# Altium schematic sheet EEG-Electrodes.SchDoc: 16 CHANNEL EEG MONITOR
size 431 x 279 mm; ApprovedBy: NA; CheckedBy: NA; Author: ANDY NGUYEN; CompanyName: NA; DrawnBy: ANDY NGUYEN; Engineer: ANDY NGUYEN; Revision: 1; ENG_APP_DATE: --/--/--; DSN_APP_DATE: --/--/--; CHK_APP_DATE: --/--/--
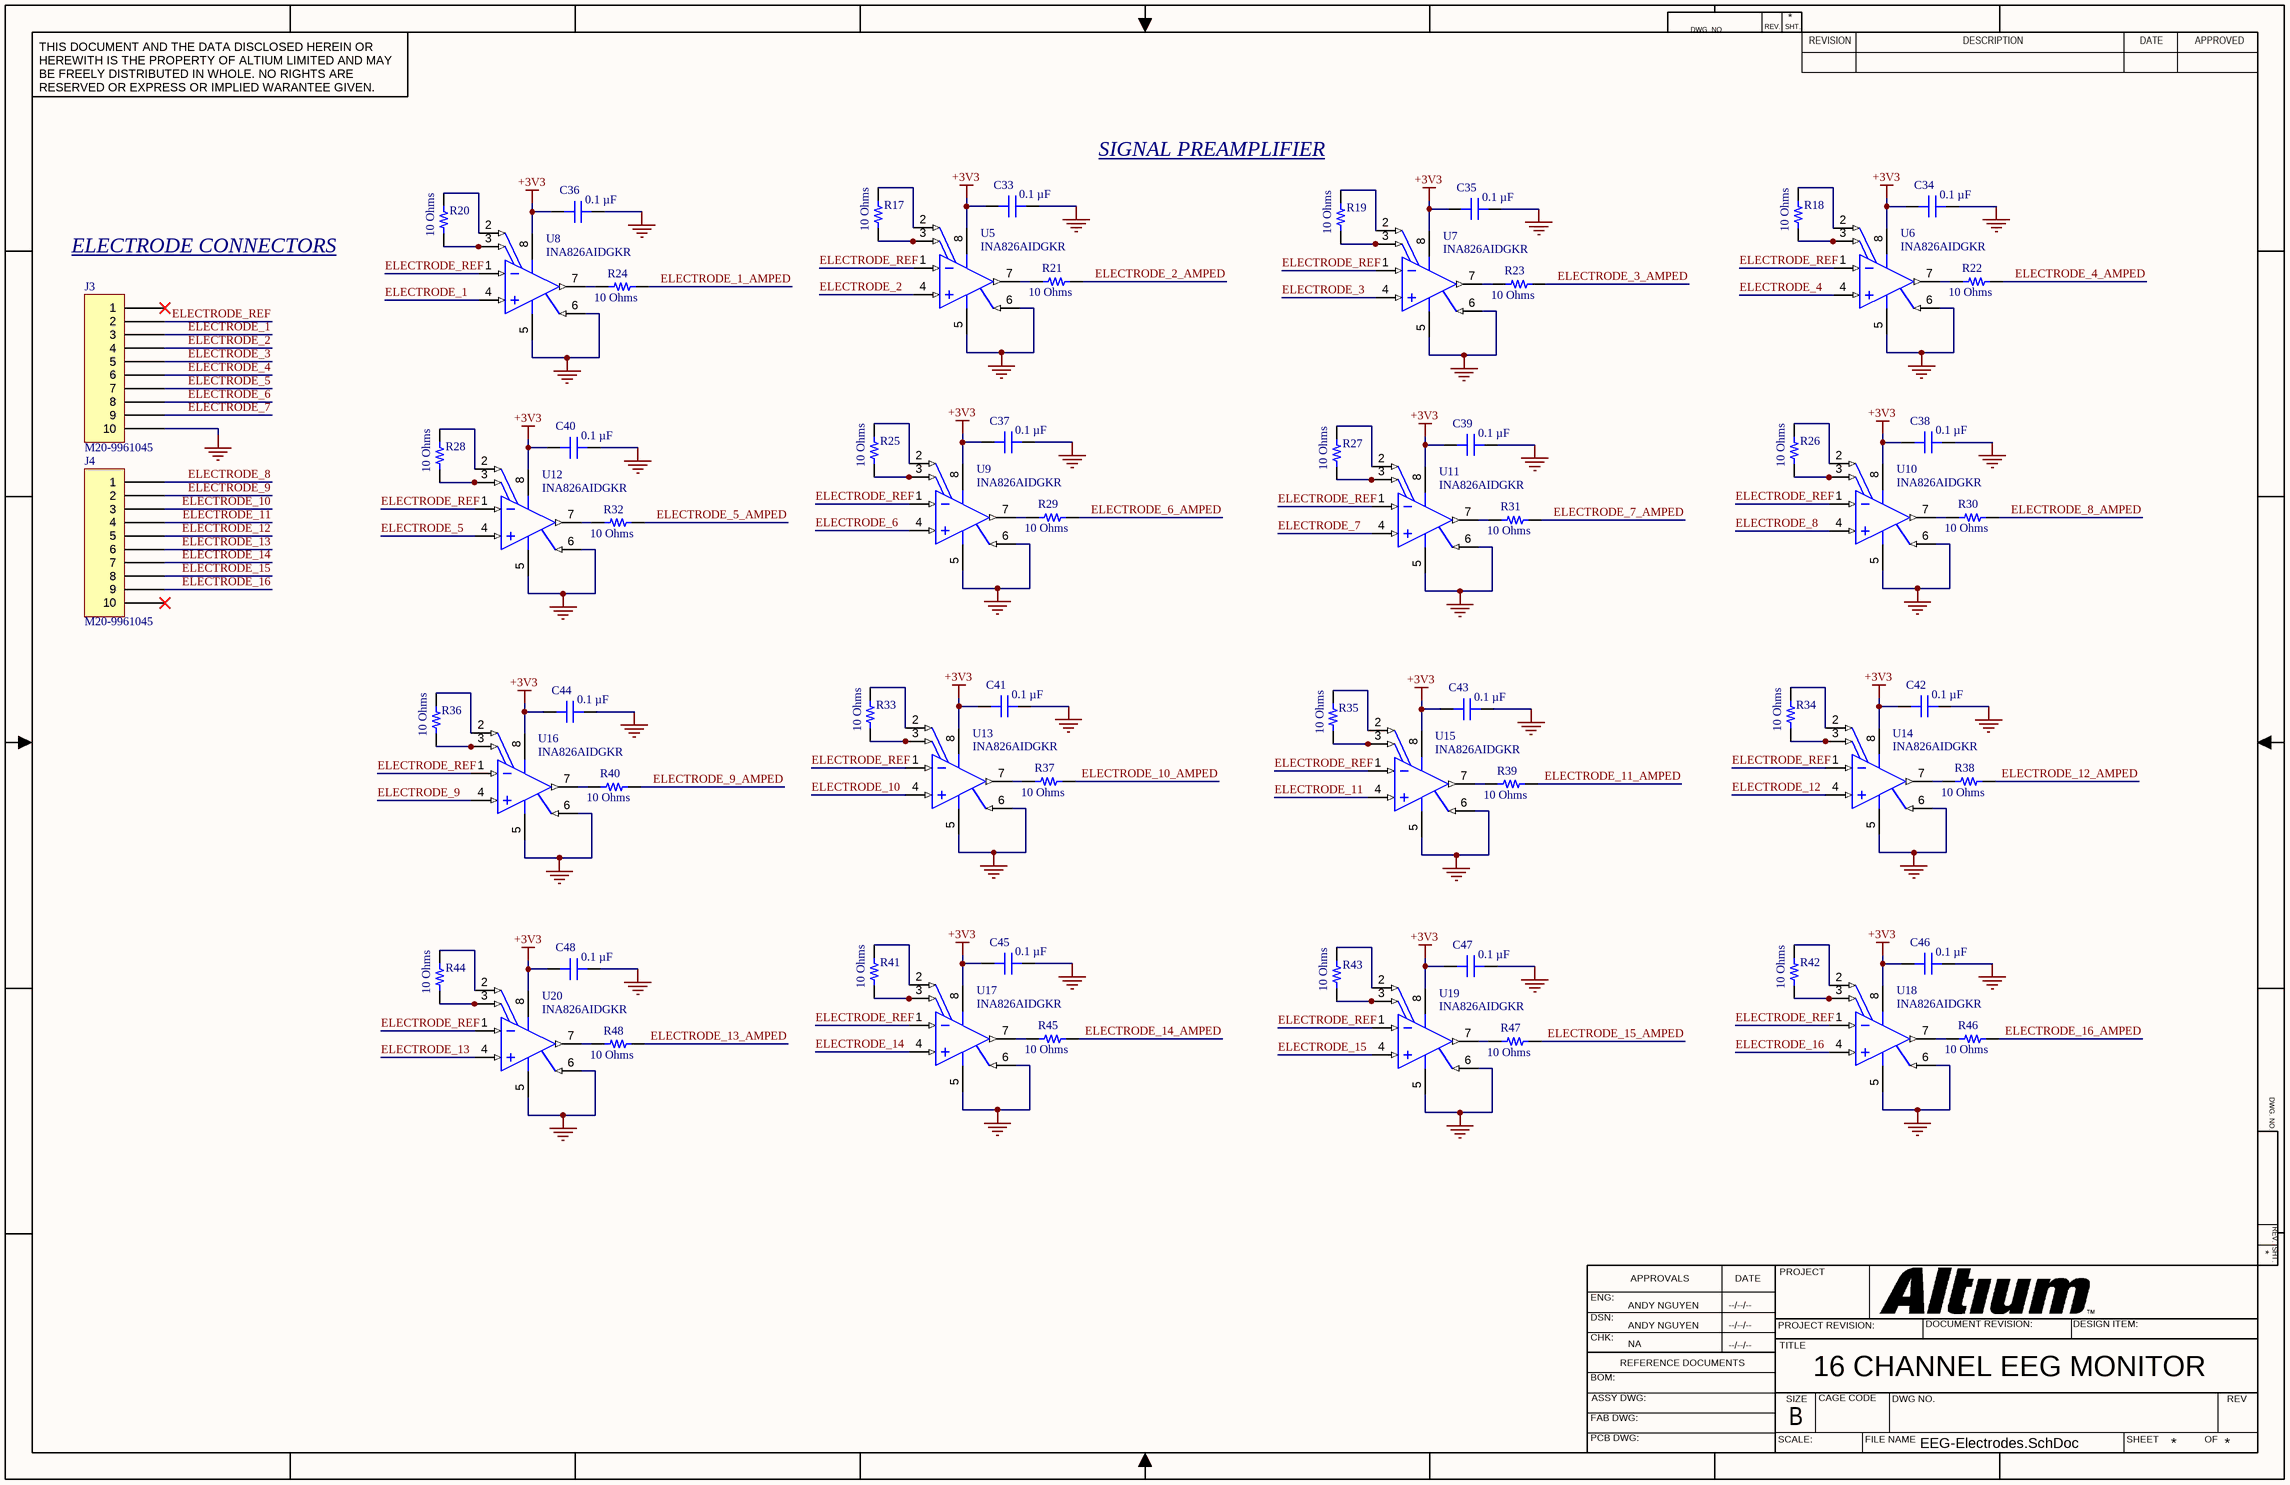
[diagram p0: EEG-Electrodes.SchDoc]

## Parts
C33  0.1 µF  [CAP 0402_1005]
C34  0.1 µF  [CAP 0402_1005]
C35  0.1 µF  [CAP 0402_1005]
C36  0.1 µF  [CAP 0402_1005]
C37  0.1 µF  [CAP 0402_1005]
C38  0.1 µF  [CAP 0402_1005]
C39  0.1 µF  [CAP 0402_1005]
C40  0.1 µF  [CAP 0402_1005]
C41  0.1 µF  [CAP 0402_1005]
C42  0.1 µF  [CAP 0402_1005]
C43  0.1 µF  [CAP 0402_1005]
C44  0.1 µF  [CAP 0402_1005]
C45  0.1 µF  [CAP 0402_1005]
C46  0.1 µF  [CAP 0402_1005]
C47  0.1 µF  [CAP 0402_1005]
C48  0.1 µF  [CAP 0402_1005]
J3  M20-9961045  [HARWIN M20-9961045]
J4  M20-9961045  [HARWIN M20-9961045]
R17  10 Ohms  [RES 0402_1005]
R18  10 Ohms  [RES 0402_1005]
R19  10 Ohms  [RES 0402_1005]
R20  10 Ohms  [RES 0402_1005]
R21  10 Ohms  [RES 0402_1005]
R22  10 Ohms  [RES 0402_1005]
R23  10 Ohms  [RES 0402_1005]
R24  10 Ohms  [RES 0402_1005]
R25  10 Ohms  [RES 0402_1005]
R26  10 Ohms  [RES 0402_1005]
R27  10 Ohms  [RES 0402_1005]
R28  10 Ohms  [RES 0402_1005]
R29  10 Ohms  [RES 0402_1005]
R30  10 Ohms  [RES 0402_1005]
R31  10 Ohms  [RES 0402_1005]
R32  10 Ohms  [RES 0402_1005]
R33  10 Ohms  [RES 0402_1005]
R34  10 Ohms  [RES 0402_1005]
R35  10 Ohms  [RES 0402_1005]
R36  10 Ohms  [RES 0402_1005]
R37  10 Ohms  [RES 0402_1005]
R38  10 Ohms  [RES 0402_1005]
R39  10 Ohms  [RES 0402_1005]
R40  10 Ohms  [RES 0402_1005]
R41  10 Ohms  [RES 0402_1005]
R42  10 Ohms  [RES 0402_1005]
R43  10 Ohms  [RES 0402_1005]
R44  10 Ohms  [RES 0402_1005]
R45  10 Ohms  [RES 0402_1005]
R46  10 Ohms  [RES 0402_1005]
R47  10 Ohms  [RES 0402_1005]
R48  10 Ohms  [RES 0402_1005]
U5  INA826AIDGKR  [DGK0008A_N]
U6  INA826AIDGKR  [DGK0008A_N]
U7  INA826AIDGKR  [DGK0008A_N]
U8  INA826AIDGKR  [DGK0008A_N]
U9  INA826AIDGKR  [DGK0008A_N]
U10  INA826AIDGKR  [DGK0008A_N]
U11  INA826AIDGKR  [DGK0008A_N]
U12  INA826AIDGKR  [DGK0008A_N]
U13  INA826AIDGKR  [DGK0008A_N]
U14  INA826AIDGKR  [DGK0008A_N]
U15  INA826AIDGKR  [DGK0008A_N]
U16  INA826AIDGKR  [DGK0008A_N]
U17  INA826AIDGKR  [DGK0008A_N]
U18  INA826AIDGKR  [DGK0008A_N]
U19  INA826AIDGKR  [DGK0008A_N]
U20  INA826AIDGKR  [DGK0008A_N]

## Nets
+3V3: C33.2 C34.2 C35.2 C36.2 C37.2 C38.2 C39.2 C40.2 C41.2 C42.2 C43.2 C44.2 C45.2 C46.2 C47.2 C48.2 U5.8(VS+) U6.8(VS+) U7.8(VS+) U8.8(VS+) U9.8(VS+) U10.8(VS+) U11.8(VS+) U12.8(VS+) U13.8(VS+) U14.8(VS+) U15.8(VS+) U16.8(VS+) U17.8(VS+) U18.8(VS+) U19.8(VS+) U20.8(VS+)
GND: C33.1 C34.1 C35.1 C36.1 C37.1 C38.1 C39.1 C40.1 C41.1 C42.1 C43.1 C44.1 C45.1 C46.1 C47.1 C48.1 J3.10 U5.5(VS-) U5.6(REF) U6.5(VS-) U6.6(REF) U7.5(VS-) U7.6(REF) U8.5(VS-) U8.6(REF) U9.5(VS-) U9.6(REF) U10.5(VS-) U10.6(REF) U11.5(VS-) U11.6(REF) U12.5(VS-) U12.6(REF) U13.5(VS-) U13.6(REF) U14.5(VS-) U14.6(REF) U15.5(VS-) U15.6(REF) U16.5(VS-) U16.6(REF) U17.5(VS-) U17.6(REF) U18.5(VS-) U18.6(REF) U19.5(VS-) U19.6(REF) U20.5(VS-) U20.6(REF)
ELECTRODE_1: J3.3 U8.4(IN+)
ELECTRODE_1_AMPED: R24.2
ELECTRODE_2: J3.4 U5.4(IN+)
ELECTRODE_2_AMPED: R21.2
ELECTRODE_3: J3.5 U7.4(IN+)
ELECTRODE_3_AMPED: R23.2
ELECTRODE_4: J3.6 U6.4(IN+)
ELECTRODE_4_AMPED: R22.2
ELECTRODE_5: J3.7 U12.4(IN+)
ELECTRODE_5_AMPED: R32.2
ELECTRODE_6: J3.8 U9.4(IN+)
ELECTRODE_6_AMPED: R29.2
ELECTRODE_7: J3.9 U11.4(IN+)
ELECTRODE_7_AMPED: R31.2
ELECTRODE_8: J4.1 U10.4(IN+)
ELECTRODE_8_AMPED: R30.2
ELECTRODE_9: J4.2 U16.4(IN+)
ELECTRODE_9_AMPED: R40.2
ELECTRODE_10: J4.3 U13.4(IN+)
ELECTRODE_10_AMPED: R37.2
ELECTRODE_11: J4.4 U15.4(IN+)
ELECTRODE_11_AMPED: R39.2
ELECTRODE_12: J4.5 U14.4(IN+)
ELECTRODE_12_AMPED: R38.2
ELECTRODE_13: J4.6 U20.4(IN+)
ELECTRODE_13_AMPED: R48.2
ELECTRODE_14: J4.7 U17.4(IN+)
ELECTRODE_14_AMPED: R45.2
ELECTRODE_15: J4.8 U19.4(IN+)
ELECTRODE_15_AMPED: R47.2
ELECTRODE_16: J4.9 U18.4(IN+)
ELECTRODE_16_AMPED: R46.2
ELECTRODE_REF: J3.2 U5.1(IN-) U6.1(IN-) U7.1(IN-) U8.1(IN-) U9.1(IN-) U10.1(IN-) U11.1(IN-) U12.1(IN-) U13.1(IN-) U14.1(IN-) U15.1(IN-) U16.1(IN-) U17.1(IN-) U18.1(IN-) U19.1(IN-) U20.1(IN-)
NetR17_1: R17.1 U5.3(RG)
NetR17_2: R17.2 U5.2(RG)
NetR18_1: R18.1 U6.3(RG)
NetR18_2: R18.2 U6.2(RG)
NetR19_1: R19.1 U7.3(RG)
NetR19_2: R19.2 U7.2(RG)
NetR20_1: R20.1 U8.3(RG)
NetR20_2: R20.2 U8.2(RG)
NetR21_1: R21.1 U5.7(VOUT)
NetR22_1: R22.1 U6.7(VOUT)
NetR23_1: R23.1 U7.7(VOUT)
NetR24_1: R24.1 U8.7(VOUT)
NetR25_1: R25.1 U9.3(RG)
NetR25_2: R25.2 U9.2(RG)
NetR26_1: R26.1 U10.3(RG)
NetR26_2: R26.2 U10.2(RG)
NetR27_1: R27.1 U11.3(RG)
NetR27_2: R27.2 U11.2(RG)
NetR28_1: R28.1 U12.3(RG)
NetR28_2: R28.2 U12.2(RG)
NetR29_1: R29.1 U9.7(VOUT)
NetR30_1: R30.1 U10.7(VOUT)
NetR31_1: R31.1 U11.7(VOUT)
NetR32_1: R32.1 U12.7(VOUT)
NetR33_1: R33.1 U13.3(RG)
NetR33_2: R33.2 U13.2(RG)
NetR34_1: R34.1 U14.3(RG)
NetR34_2: R34.2 U14.2(RG)
NetR35_1: R35.1 U15.3(RG)
NetR35_2: R35.2 U15.2(RG)
NetR36_1: R36.1 U16.3(RG)
NetR36_2: R36.2 U16.2(RG)
NetR37_1: R37.1 U13.7(VOUT)
NetR38_1: R38.1 U14.7(VOUT)
NetR39_1: R39.1 U15.7(VOUT)
NetR40_1: R40.1 U16.7(VOUT)
NetR41_1: R41.1 U17.3(RG)
NetR41_2: R41.2 U17.2(RG)
NetR42_1: R42.1 U18.3(RG)
NetR42_2: R42.2 U18.2(RG)
NetR43_1: R43.1 U19.3(RG)
NetR43_2: R43.2 U19.2(RG)
NetR44_1: R44.1 U20.3(RG)
NetR44_2: R44.2 U20.2(RG)
NetR45_1: R45.1 U17.7(VOUT)
NetR46_1: R46.1 U18.7(VOUT)
NetR47_1: R47.1 U19.7(VOUT)
NetR48_1: R48.1 U20.7(VOUT)

Not connected (* = marked no-connect by the designer): J3 1*; J4 10*

## Notes on the sheet
- SIGNAL PREAMPLIFIER
- (near J3) ELECTRODE CONNECTORS
- DWG. NO.
- REV.
- SHT.
- THIS DOCUMENT AND THE DATA DISCLOSED HEREIN OR HEREWITH IS THE PROPERTY OF ALTIUM LIMITED AND MAY BE FREELY DISTRIBUTED IN WHOLE. NO RIGHTS ARE RESERVED OR EXPRESS OR IMPLIED WARANTEE GIVEN.
- REVISION
- DESCRIPTION
- DATE
- APPROVED
- ENG:
- APPROVALS
- PROJECT
- DSN:
- CHK:
- REFERENCE DOCUMENTS
- PROJECT REVISION:
- TITLE
- DOCUMENT REVISION:
- DESIGN ITEM:
- BOM:
- FAB DWG:
- PCB DWG:
- ASSY DWG:
- SCALE:
- SIZE
- B
- CAGE CODE
- FILE NAME
- DWG NO.
- SHEET
- OF
- REV

## Library data of the parts
C33-C48 = C0402C104K4RECAUTO: CAP CER 0402 0.1UF 16V X7R 10%; manufacturer: KEMET; Part Number: C0402C104K4RECAUTO; Value: 0.1 µF; Applications: Automotive, ESD Protection; Capacitance: 0.1 µF; componentlink1description: Datasheet; componentlink1url: https://api.kemet.com/component-edge/download/datasheet/C0402C104K4RECAUTO.pdf; componentlink2description: DigiKey Link; componentlink2url: https://www.digikey.com/en/products/detail/kemet/C0402C104K4RECAUTO/8563695; Device Package: 0402 (1005 Metric); lastupdated: 1/28/2024 8:04:20 PM; Lifecycle Status: Active; Minimum Order: 1; Mounting Type: Surface Mount, MLCC; Operating Temperature: -55°C ~ 125°C; Package / Case: 0402 (1005 Metric); packaging: TapeAndReel; partid: 1731; Part Status: Active; price: 0.01; Ratings: AEC-Q200; series: ESD SMD Auto X7R; Size / Dimension: 0.039" L x 0.020" W (1.00mm x 0.50mm); Supplier 1: DigiKey; Supplier Part Number 1: 399-17167-1-ND; Temperature Coefficient: X7R; Thickness (Max): 0.022" (0.55mm); Tolerance: ±10%; Voltage - Rated: 16V
J3 J4 = M20-9961045: CONN HEADER R/A 10POS 2.54MM; Manufacturer: Harwin Inc.; Connector Type: Header, Cuttable; Contact Length - Mating: 0.240" (6.10mm); Contact Length - Post: 0.118" (3.00mm); Current Rating (Amps): 3A per Contact; Material Flammability Rating: UL94 V-0; Number of Positions: 10; Number of Positions Loaded: All; Pitch - Mating: 0.100" (2.54mm); Row Spacing - Mating: -40°C ~ 105°C; Shrouding: Unshrouded; Style: Board to Board or Cable; Part Number: M20-9961045; ComponentLink1Description: Datasheet; ComponentLink1URL: https://cdn.harwin.com/pdfs/Harwin_PC_Connectors_M20.pdf; ComponentLink2Description: DigiKey Link; ComponentLink2URL: https://www.digikey.com/en/products/detail/harwin-inc/M20-9961045/3728214; Contact Finish - Mating: Gold; Contact Material: Brass; Contact Shape: Square; Contact Type: Male Pin; Fastening Type: Push-Pull; Insulation Color: Black; Insulation Height: 0.100" (2.54mm); Insulation Material: Polyamide (PA6T), Nylon 6T; LastUpdated: 9/21/2022 7:24:27 PM; Lifecycle Status: Active; Minimum Order: 1; Mounting Type: Through Hole, Right Angle; Number of Rows: 1; Operating Temperature: -40°C ~ 105°C; Packaging: Bulk; PartId: 172; Part Status: Active; Price: 0.26; Series: M20; Supplier 1: DigiKey; Supplier Part Number 1: 952-2250-ND; Termination: Solder
R17-R48 = ERA-2AKD100X: RES SMD 10 OHM 0.5% 1/16W 0402; Manufacturer: Panasonic Electronic Components; Power (Watts): 0.063W, 1/16W; Temperature Coefficient: ±100ppm/°C; Part Number: ERA-2AKD100X; Value: 10 Ohms; ComponentLink1Description: Datasheet; ComponentLink1URL: https://industrial.panasonic.com/cdbs/www-data/pdf/RDM0000/AOA0000C307.pdf; ComponentLink2Description: DigiKey Link; ComponentLink2URL: https://www.digikey.com/en/products/detail/panasonic-electronic-components/ERA-2AKD100X/1706054; Composition: Thin Film; Device Package: 0402 (1005 Metric); Features: Automotive AEC-Q200; Height - Seated (Max): 0.016" (0.40mm); LastUpdated: 1/29/2024 8:27:58 PM; Lifecycle Status: Active; Minimum Order: 1; Number of Terminations: 2; Operating Temperature: -55°C ~ 155°C; Package / Case: 0402 (1005 Metric); Packaging: TapeAndReel; PartId: 3168; Part Status: Active; Price: 0.02; Ratings: AEC-Q200; Resistance: 10 Ohms; Series: ERA-2A; Size / Dimension: 0.039" L x 0.020" W (1.00mm x 0.50mm); Supplier 1: DigiKey; Supplier Part Number 1: P10DDCT-ND; Supplier Device Package: 0402; Tolerance: ±0.5%
U5-U20 = CMP-0944-00060-2: Precision, 200-uA Supply Current, 36-V Supply Instrumentation Amplifier, -40 to 125 degC, 8-pin SOP (DGK8), Green (RoHS & no Sb/Br); Manufacturer: Texas Instruments; Output Offset (+/-)(Max)(uV): 700; Input Offset Drift (+/-)(Max)(uV/Degrees Celsius): 2; Vs(Max)(V): 36; Non-Linearity (+/-)(Max)(%): 0.0005; Input Offset (+/-)(Max)(uV): 150; Output Offset Drift (+/-)(Max)(uV/Degrees Celsius): 10; Gain(V/V): 1 to 1000; CMRR(Min)(dB): 84; Noise at 1kHz(Typ)(nV/rt(Hz)): 18; Vs(Min)(V): 2.7; SubFamily: Single Supply; Number of Channels: 1; Input Bias Current (+/-)(Max)(nA): 65; Quiescent Current (+/-)(Typ)(mA): 0.2; ComponentLink1Description: Manufacturer URL; PartNumber: INA826AIDGKR; ComponentLink2URL: http://www.ti.com/general/docs/lit/getliterature.tsp?genericPartNumber=INA826&fileType=pdf; Code_JEDEC: MO-187; Eco-Plan: Green (RoHS & no Sb/Br); ComponentLink3URL: http://www.ti.com/litv/pdf/mpds028d; Mounting Technology: Surface Mount; ComponentLink3Description: Package Specification; PackageReference: DGK0008A; ComponentLink2Description: Datasheet; DatasheetVersion: SBOS562E; ComponentLink1URL: http://www.ti.com/; PackageDescription: 8-Pin Thin Small Outline, Body 3 x 3 mm, Pitch 0.65 mm; PackageVersion: 4073329/E, 05/2006